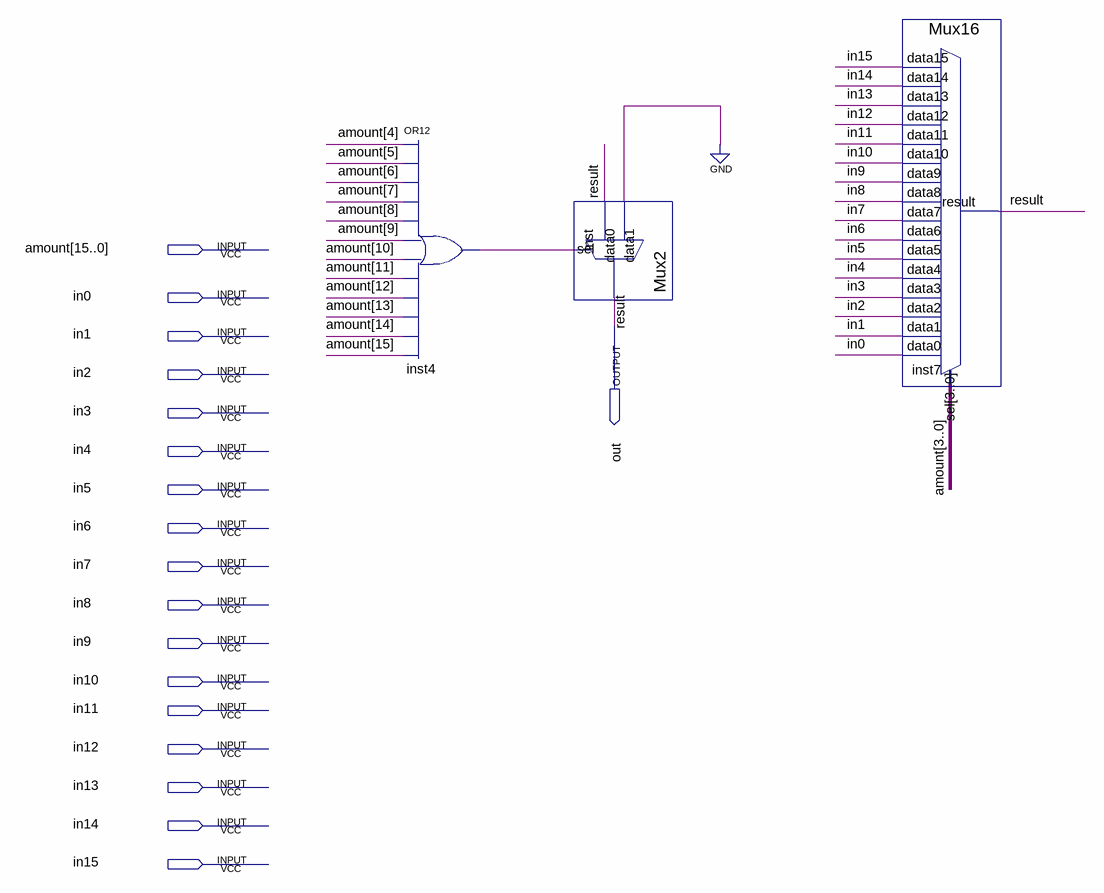
[diagram p0: schematic sheet]
// Quartus schematic ShiftControl.bdf as structural Verilog: 3 symbols, 18 pins
module ShiftControl (
  input  [15:0] amount,
  input  in0,
  input  in1,
  input  in2,
  input  in3,
  input  in4,
  input  in5,
  input  in6,
  input  in7,
  input  in8,
  input  in9,
  input  in10,
  input  in11,
  input  in12,
  input  in13,
  input  in14,
  input  in15,
  output out
);

  wire inst4_out, result;

  or inst4 (inst4_out, amount[4], amount[5], amount[6], amount[7], amount[8], amount[9], amount[10], amount[11], amount[12], amount[13], amount[14], amount[15]);
  Mux2 inst (.data1(1'b0), .data0(result), .sel(inst4_out), .result(out));
  Mux16 inst7 (
    .data15(in15), .data14(in14), .data13(in13), .data12(in12), .data11(in11), .data10(in10), .data9(in9),
    .data8(in8), .data7(in7), .data6(in6), .data5(in5), .data4(in4), .data3(in3), .data2(in2), .data1(in1),
    .data0(in0), .sel(amount[3:0]), .result(result));
endmodule
